# EAGLE design BT_IMU_2_0 (EAGLE 9.6.2)
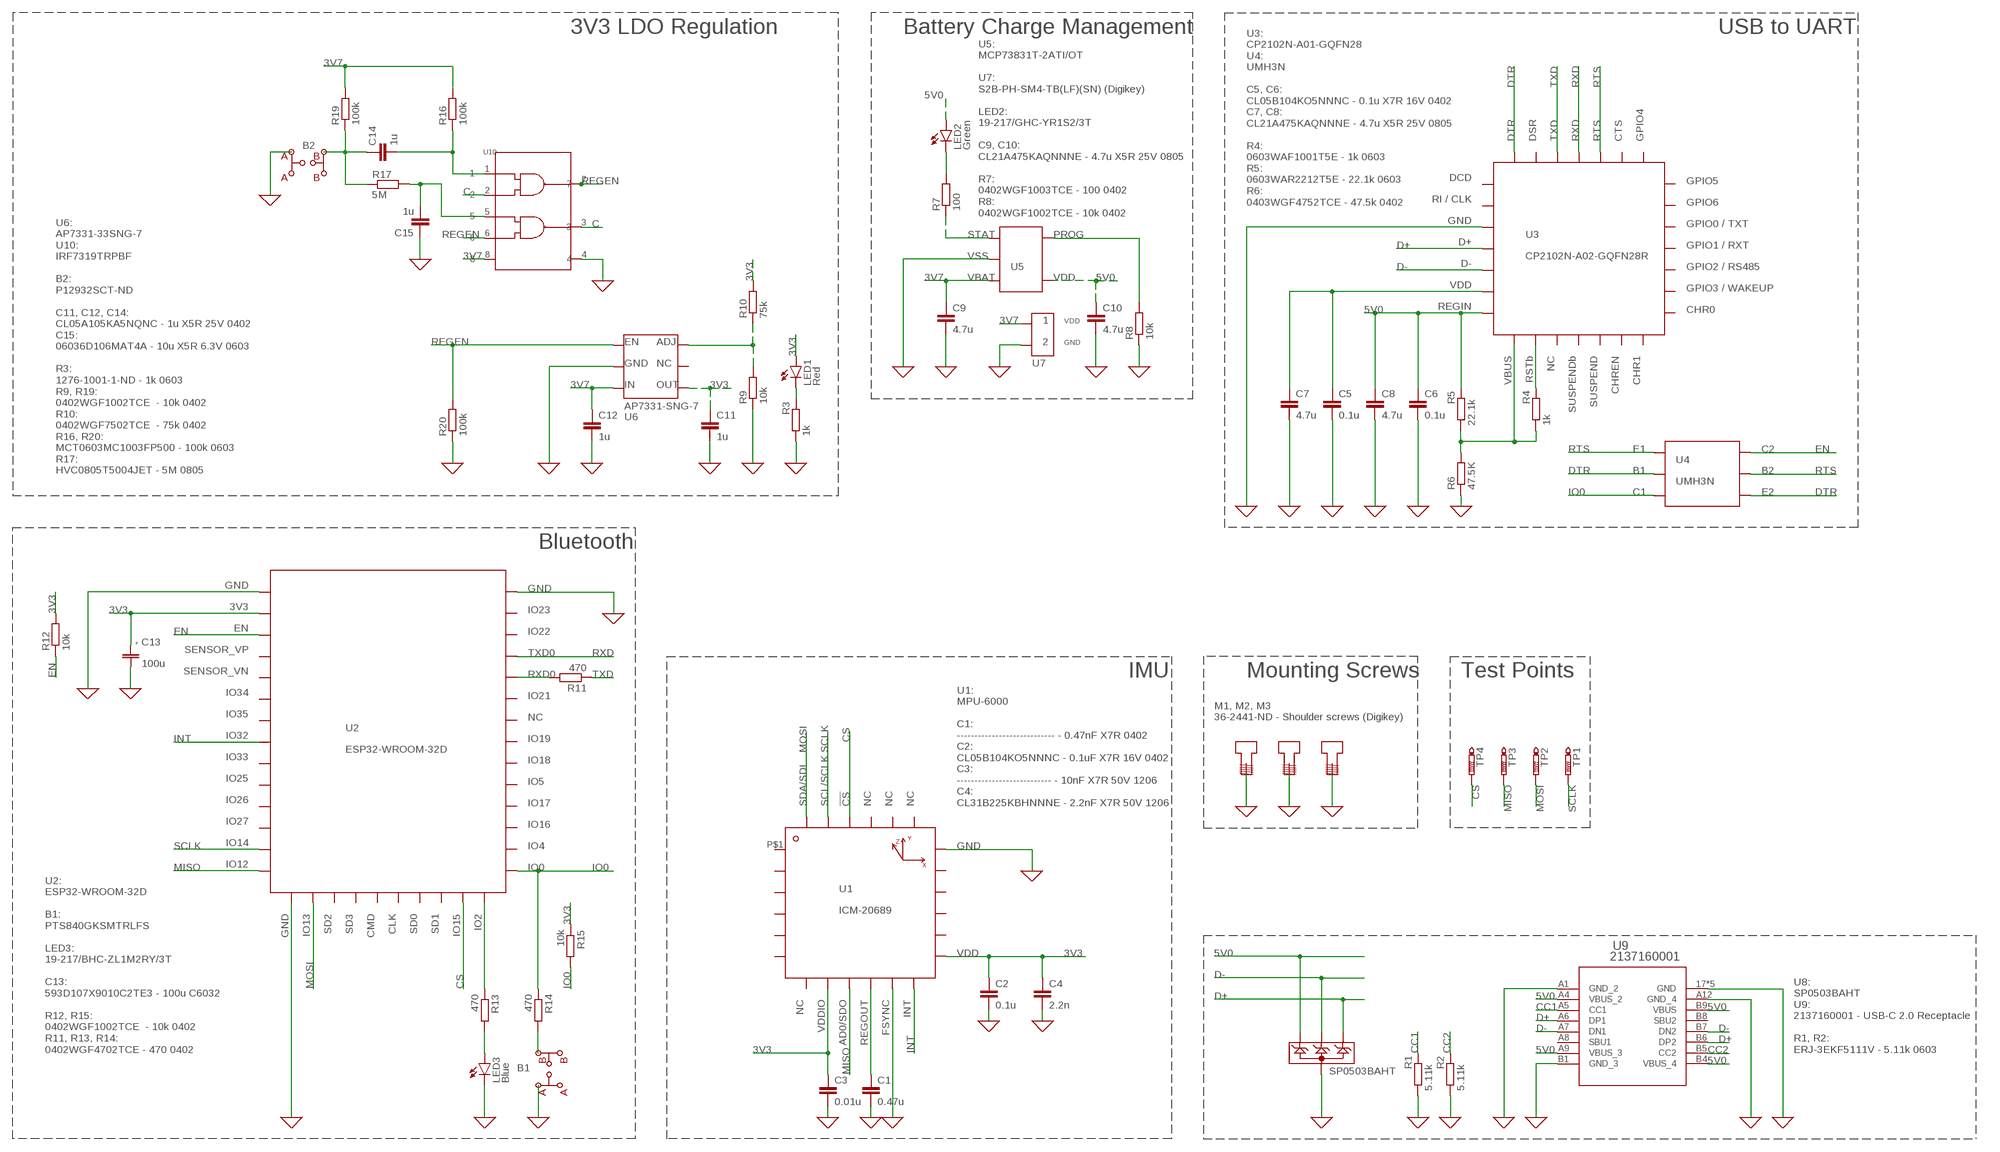
[diagram p0: schematic, sheet 1]

## Parts
B1  P12932SCT-ND  [P12932SCT-ND]
B2  P12932SCT-ND  [P12932SCT-ND]
C1  0.47u  C-EUC0603  [C0603]
C2  0.1u  C-EUC0402  [C0402]
C3  0.01u  C-EUC0402  [C0402]
C4  2.2n  C-EUC1206  [C1206]
C5  0.1u  C-EUC0402  [C0402]
C6  0.1u  C-EUC0402  [C0402]
C7  4.7u  C-EUC0805  [C0805]
C8  4.7u  C-EUC0805  [C0805]
C9  4.7u  C-EUC0805  [C0805]
C10  4.7u  C-EUC0805  [C0805]
C11  1u  C-EUC0402  [C0402]
C12  1u  C-EUC0402  [C0402]
C13  100u  593D107X9010C2TE3  [C6032]
C14  1u  C-EUC0402  [C0402]
C15  1u  C-EUC0603  [C0603]
LED1  Red  LEDCHIP-LED0603  [CHIP-LED0603]
LED2  Green  LEDSML0603  [SML0603]
LED3  Blue  LEDSML0603  [SML0603]
M1  2441  [2441]
M2  2441  [2441]
M3  2441  [2441]
R1  5.11k  R-EU_R0603  [R0603]
R2  5.11k  R-EU_R0603  [R0603]
R3  1k  R-EU_R0603  [R0603]
R4  1k  R-EU_R0603  [R0603]
R5  22.1k  R-EU_R0603  [R0603]
R6  47.5K  R-EU_R0402  [R0402]
R7  100  R-EU_R0402  [R0402]
R8  10k  R-EU_R0402  [R0402]
R9  10k  R-EU_R0402  [R0402]
R10  75k  R-EU_R0402  [R0402]
R11  470  R-EU_R0402  [R0402]
R12  10k  R-EU_R0402  [R0402]
R13  470  R-EU_R0402  [R0402]
R14  470  R-EU_R0402  [R0402]
R15  10k  R-EU_R0402  [R0402]
R16  100k  R-EU_R0603  [R0603]
R17  5M  R-EU_R0805  [R0805]
R19  100k  R-EU_R0603  [R0603]
R20  100k  R-EU_R0603  [R0603]
TP1  PTR1B1,27  [B1,27]
TP2  PTR1B1,27  [B1,27]
TP3  PTR1B1,27  [B1,27]
TP4  PTR1B1,27  [B1,27]
U1  ICM-20689  [24-QFN(4X4)]
U2  ESP32-WROOM-32D  [ESP32-WROOM-32D]
U3  CP2102N-A02-GQFN28R  [28-QFN(5X5)]
U4  UMH3N  [UMT6]
U5  MCP73831T-2ATI/OT  [SOT-23-5]
U6  AP7331-SNG-7  [U-DFN2020-6]
U7  S2B-PH-SM4-TB(LF)(SN)  [S2B-PH-SM4-TB(LF)(SN)]
U8  SP0503BAHT  [SOT-143-4]
U9  2137160001  [2137160001_MOL]
U10  TC7WZ00FKSOT-765  [SOT-765]

## Nets
0: B1.P$2 B2.P$2 C1.2 C2.2 C3.2 C4.2 C5.2 C6.2 C7.2 C8.2 C9.2 C10.2 C11.2 C12.2 C13.P$2 C15.1 LED3.C M1.P$1 M2.P$1 M3.P$1 R1.1 R2.1 R3.1 R6.1 R8.1 R9.1 R20.1 U1.P$11 U1.P$18 U2.P$1 U2.P$15 U2.P$38 U2.P$39 U2.P$40 U2.P$41 U2.P$42 U2.P$43 U2.P$44 U2.P$45 U2.P$46 U2.P$47 U3.P$2 U3.P$28 U3.P$29 U3.P$30 U3.P$31 U3.P$32 U3.P$33 U3.P$34 U3.P$35 U3.P$36 U5.P$2 U6.P$2 U6.P$7 U6.P$8 U7.P$2 U8.P$1 U9.17(GND) U9.18(GND) U9.19(GND) U9.20(GND) U9.A1(GND_2) U9.A12(GND_4) U9.B1(GND_3) U9.B12(GND) U10.4 ; supply symbol labelled GND
3V3: C2.1 C3.1 C4.1 C11.1 C13.P$1 LED1.A R10.2 R12.2 R15.1 U1.P$8 U1.P$13 U2.P$2 U6.P$4
3V7: C9.1 C12.1 R16.2 R19.2 U5.P$3 U6.P$3 U7.P$1 U10.8
5V0: C6.1 C8.1 C10.1 LED2.A R5.2 U3.P$6 U5.P$4 U8.P$2 U9.A4(VBUS_2) U9.A9(VBUS_3) U9.B4(VBUS_4) U9.B9(VBUS)
C: U10.2 U10.3
CC1: R1.2 U9.A5(CC1)
CC2: R2.2 U9.B5(CC2)
CS: TP4.TP U1.P$22 U2.P$23
D+: U3.P$3 U8.P$4 U9.A6(DP1) U9.B6(DP2)
D-: U3.P$4 U8.P$3 U9.A7(DN1) U9.B7(DN2)
DTR: U3.P$27 U4.P$2 U4.P$4
EN: R12.1 U2.P$3 U4.P$6
INT: U1.P$12 U2.P$8
IO0: R14.1 R15.2 U2.P$25 U4.P$3
MISO: TP3.TP U1.P$9 U2.P$14
MOSI: TP2.TP U1.P$24 U2.P$16
N$1: C1.1 U1.P$10
N$2: B1.P$4 R14.2
N$3: LED1.C R3.2
N$4: R4.2 U3.P$8
N$5: R4.1 R5.1 R6.2 U3.P$7
N$6: C5.1 C7.1 U3.P$5
N$7: R7.1 U5.P$1
N$8: R11.2 U2.P$34
N$9: R8.2 U5.P$5
N$10: LED2.C R7.2
N$11: R9.2 R10.1 U6.P$6
N$12: R13.1 U2.P$24
N$13: C15.2 R17.2 U10.5
N$14: B2.P$4 C14.1 R17.1 R19.1
N$15: LED3.A R13.2
N$16: C14.2 R16.1 U10.1
REGEN: R20.2 U6.P$1 U10.6 U10.7
RTS: U3.P$23 U4.P$1 U4.P$5
RXD: U2.P$35 U3.P$24
SCLK: TP1.TP U1.P$23 U2.P$13
TXD: R11.1 U3.P$25
Unconnected: B1.P$1 B1.P$3 B2.P$1 B2.P$3 U1.P$1 U1.P$2 U1.P$3 U1.P$4 U1.P$5 U1.P$6 U1.P$7 U1.P$14 U1.P$15 U1.P$16 U1.P$17 U1.P$19 U1.P$20 U1.P$21 U2.P$4 U2.P$5 U2.P$6 U2.P$7 U2.P$9 U2.P$10 U2.P$11 U2.P$12 U2.P$17 U2.P$18 U2.P$19 U2.P$20 U2.P$21 U2.P$22 U2.P$26 U2.P$27 U2.P$28 U2.P$29 U2.P$30 U2.P$31 U2.P$32 U2.P$33 U2.P$36 U2.P$37 U3.P$0 U3.P$1 U3.P$9 U3.P$10 U3.P$11 U3.P$12 U3.P$13 U3.P$14 U3.P$15 U3.P$16 U3.P$17 U3.P$18 U3.P$19 U3.P$20 U3.P$21 U3.P$22 U3.P$26 U6.P$5 U9.A8(SBU1) U9.B8(SBU2)

## Notes on the sheet
- 3V3 LDO Regulation | Battery Charge Management | USB to UART
- U3:
  CP2102N-A01-GQFN28
  U4:
  UMH3N
  
  C5, C6:
  CL05B104KO5NNNC - 0.1u X7R 16V 0402
  C7, C8:
  CL21A475KAQNNNE - 4.7u X5R 25V 0805
  
  R4:
  0603WAF1001T5E - 1k 0603
  R5:
  0603WAR2212T5E - 22.1k 0603
  R6:
  0403WGF4752TCE - 47.5k 0402
- U5:
  MCP73831T-2ATI/OT
  
  U7:
  S2B-PH-SM4-TB(LF)(SN) (Digikey)
  
  LED2:
  19-217/GHC-YR1S2/3T 
  
  C9, C10:
  CL21A475KAQNNNE - 4.7u X5R 25V 0805
  
  R7:
  0402WGF1003TCE - 100 0402
  R8:
  0402WGF1002TCE - 10k 0402
- U5
- U6
- U6:
  AP7331-33SNG-7
  U10:
  IRF7319TRPBF
  
  B2:
  P12932SCT-ND
  
  C11, C12, C14:
  CL05A105KA5NQNC - 1u X5R 25V 0402
  C15:
  06036D106MAT4A - 10u X5R 6.3V 0603
  
  R3:
  1276-1001-1-ND - 1k 0603
  R9, R19:
  0402WGF1002TCE  - 10k 0402
  R10:
  0402WGF7502TCE  - 75k 0402
  R16, R20:
  MCT0603MC1003FP500 - 100k 0603
  R17:
  HVC0805T5004JET - 5M 0805
- Bluetooth
- IMU | Mounting Screws | Test Points
- M1, M2, M3
  36-2441-ND - Shoulder screws (Digikey)
- U1:
  MPU-6000
  
  C1:
  ---------------------------- - 0.47nF X7R 0402
  C2:
  CL05B104KO5NNNC - 0.1uF X7R 16V 0402
  C3:
  --------------------------- - 10nF X7R 50V 1206
  C4:
  CL31B225KBHNNNE - 2.2nF X7R 50V 1206
- U2:
  ESP32-WROOM-32D
  
  B1:
  PTS840GKSMTRLFS
  
  LED3:
  19-217/BHC-ZL1M2RY/3T
  
  C13:
  593D107X9010C2TE3 - 100u C6032
  
  R12, R15:
  0402WGF1002TCE  - 10k 0402
  R11, R13, R14:
  0402WGF4702TCE - 470 0402
- U8:
  SP0503BAHT
  U9:
  2137160001 - USB-C 2.0 Receptacle
  
  R1, R2:
  ERJ-3EKF5111V - 5.11k 0603

## Library data of the parts
B1 B2 = Panasonic:P12932SCT-ND
C1-C12 C14 C15 = rcl:C-EU: CAPACITOR, European symbol; SPICEPREFIX: C
C13 = Vishay:593D107X9010C2TE3
LED1-LED3 = led:LED: LED OSRAM: - CHIPLED LG R971, LG N971, LY N971, LG Q971, LY Q971, LO R971, LY R971 LH N974, LH R974 LS Q976, LO Q976, LY Q976 LO Q996 - Hyper CHIPLED LW Q18S LB Q993, LB Q99A, LB R99A - SideLED LS A670, LO A670, LY A670, LG A670, LP A670 LB A673, LV A673, LT A673, LW A673 LH A674 LY A675 LS A676, LA A676, LO A676, LY A676, LW A676 LS A679, LY A679, LG A679 - Hyper Micro SIDELED® LS Y876, LA Y876, LO Y876, LY Y876 LT Y87S - SmartLED LW L88C, LW L88S LB L89C, LB L89S, LG L890 LS L89K, LO L89K, LY L89K LS L896, LA L896, LO L896, LY L896 - TOPLED LS T670, LO T670, LY T670, LG T670, LP T670 LSG T670, LSP T670, LSY T670, LOP T670, LYG T670 LG T671, LOG T671, LSG T671 LB T673, LV T673, LT T673, LW T673 LH T674 LS T676, LA T676, LO T676, LY T676, LB T676, LH T676, LSB T676, LW T676 LB T67C, LV T67C, LT T67C, LS T67K, LO T67K, LY T67K, LW E67C LS E67B, LA E67B, LO E67B, LY E67B, LB E67C, LV E67C, LT E67C LW T67C LS T679, LY T679, LG T679 LS T770, LO T770, LY T770, LG T770, LP T770 LB T773, LV T773, LT T773, LW T773 LH T774 LS E675, LA E675, LY E675, LS T675 LS T776, LA T776, LO T776, LY T776, LB T776 LHGB T686 LT T68C, LB T68C - Hyper Mini TOPLED® LB M676 - Mini TOPLED Santana® LG M470 LS M47K, LO M47K, LY M47K Source: http://www.osram.convergy.de LUXEON: - LUMILED® LXK2-PW12-R00, LXK2-PW12-S00, LXK2-PW14-U00, LXK2-PW14-V00 LXK2-PM12-R00, LXK2-PM12-S00, LXK2-PM14-U00 LXK2-PE12-Q00, LXK2-PE12-R00, LXK2-PE12-S00, LXK2-PE14-T00, LXK2-PE14-U00 LXK2-PB12-K00, LXK2-PB12-L00, LXK2-PB12-M00, LXK2-PB14-N00, LXK2-PB14-P00, LXK2-PB14-Q00 LXK2-PR12-L00, LXK2-PR12-M00, LXK2-PR14-Q00, LXK2-PR14-R00 LXK2-PD12-Q00, LXK2-PD12-R00, LXK2-PD12-S00 LXK2-PH12-R00, LXK2-PH12-S00 LXK2-PL12-P00, LXK2-PL12-Q00, LXK2-PL12-R00 Source: www.luxeon.com KINGBRIGHT: KA-3528ASYC Source: www.kingbright.com
M1-M3 = Keystone Electronics:2441
R1-R17 R19 R20 = rcl:R-EU_: RESISTOR, European symbol; SPICEPREFIX: R
TP1-TP4 = testpad:PTR1: TEST PIN
U1 = InvenSense:ICM-20689
U2 = ESPRESSIF:ESP32-WROOM-32D: ESPRESSIF ESP32-WROOM-32D development board
U3 = Silicon Labs:CP2102N-A02-GQFN28R
U4 = ROHM Semiconductor:UMH3N
U5 = Microchip:MCP73831T-2ATI/OT
U6 = Diodes Encorporated:AP7331-SNG-7: IC REG LIN POS ADJ 300MA 6DFN
U7 = JST:S2B-PH-SM4-TB(LF)(SN)
U8 = Littelfuse Inc:SP0503BAHT
U9 = USB Connectors:2137160001; BUILT_BY: EMA_Cory; COPYRIGHT: Copyright (C) 2018 Accelerated Designs. All rights reserved; DATASHEET: https://www.molex.com/pdm_docs/sd/2137160001_sd.pdf; MANUFACTURER_PART_NUMBER: 2137160001; SOURCELIBRARY: Add_to_database_2021-03-05; VENDOR: Molex Connector Corporation
U10 = Toshiba:TC7WZ00FK

## Board
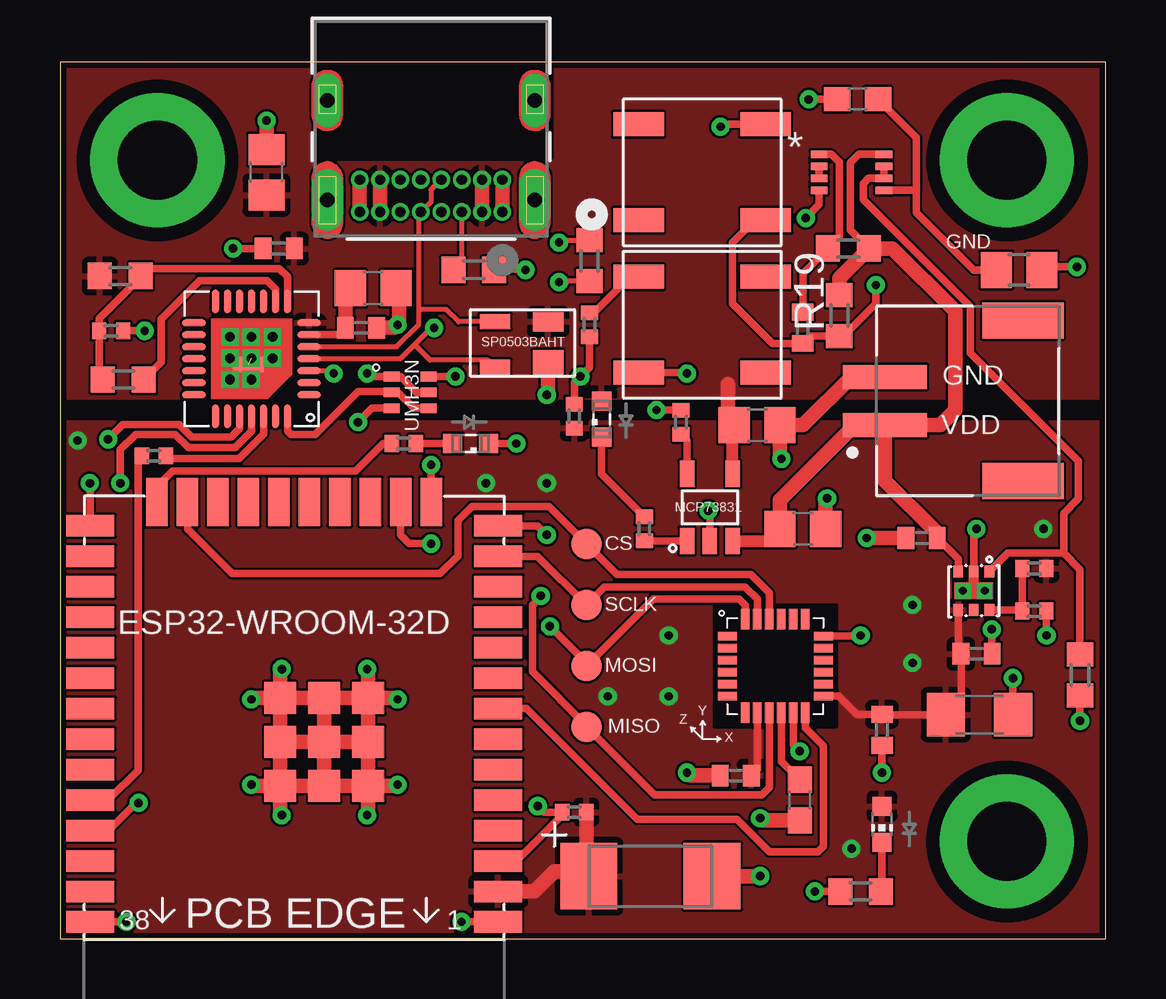
[diagram p1: board, top side]
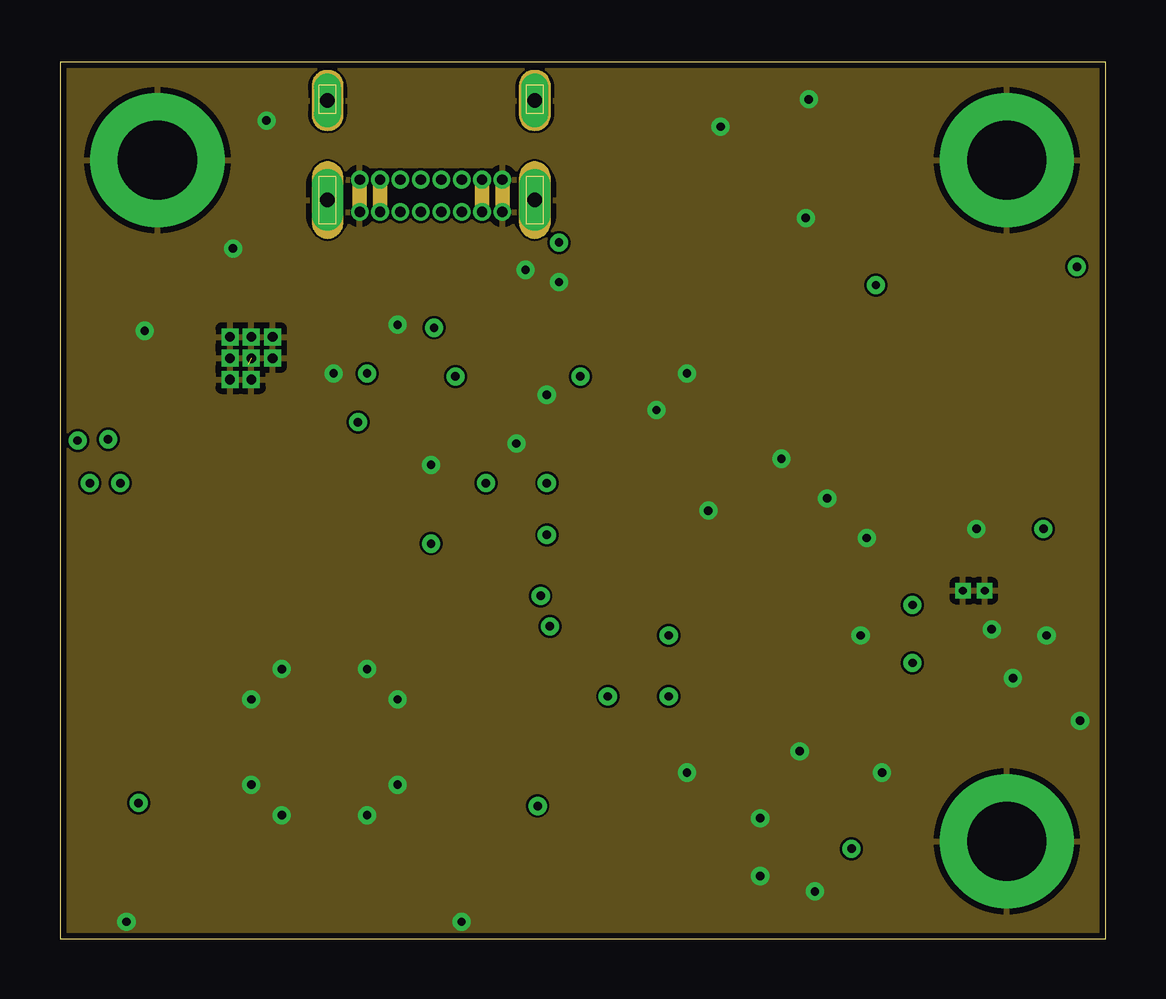
[diagram p2: board, inner layer Route2]
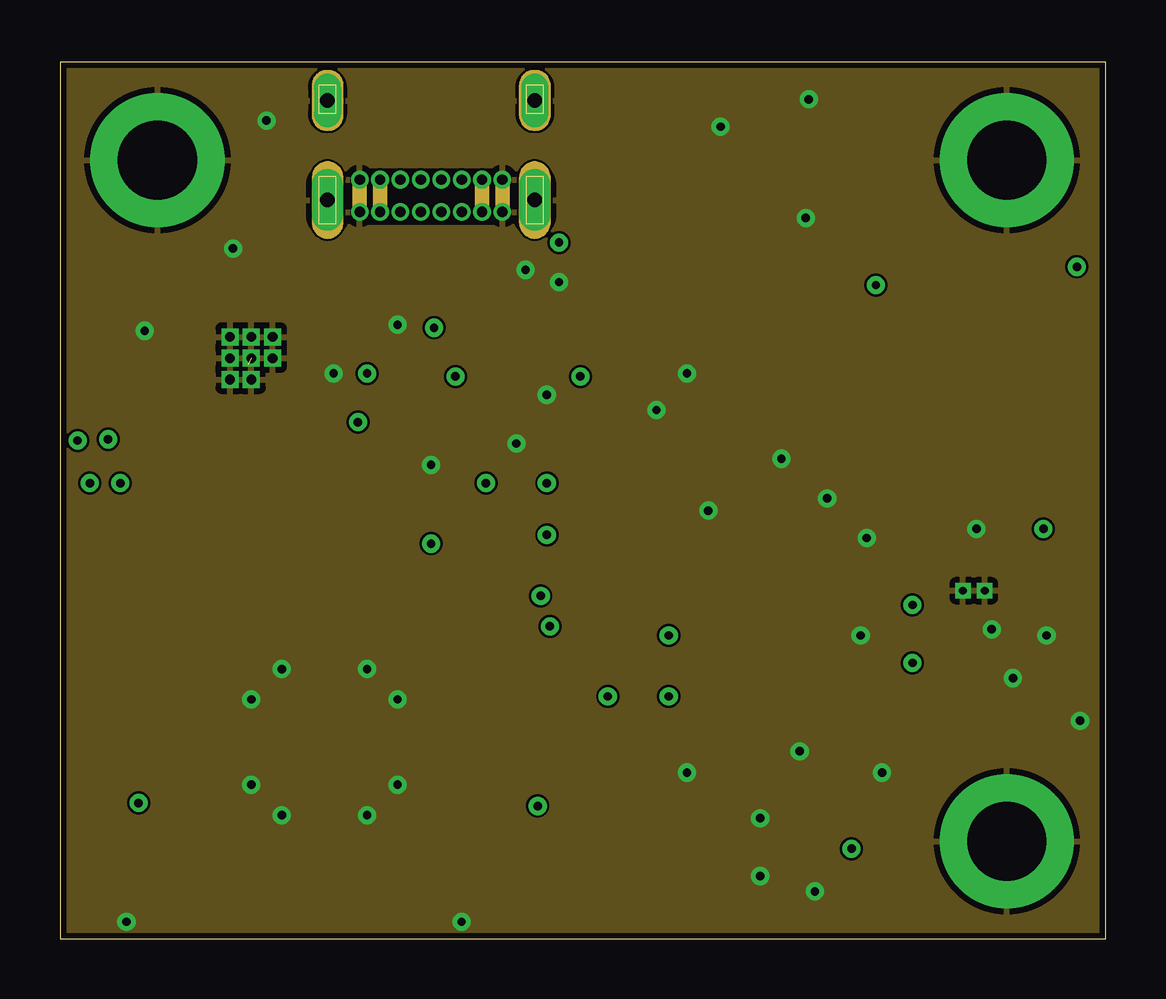
[diagram p3: board, inner layer Route15]
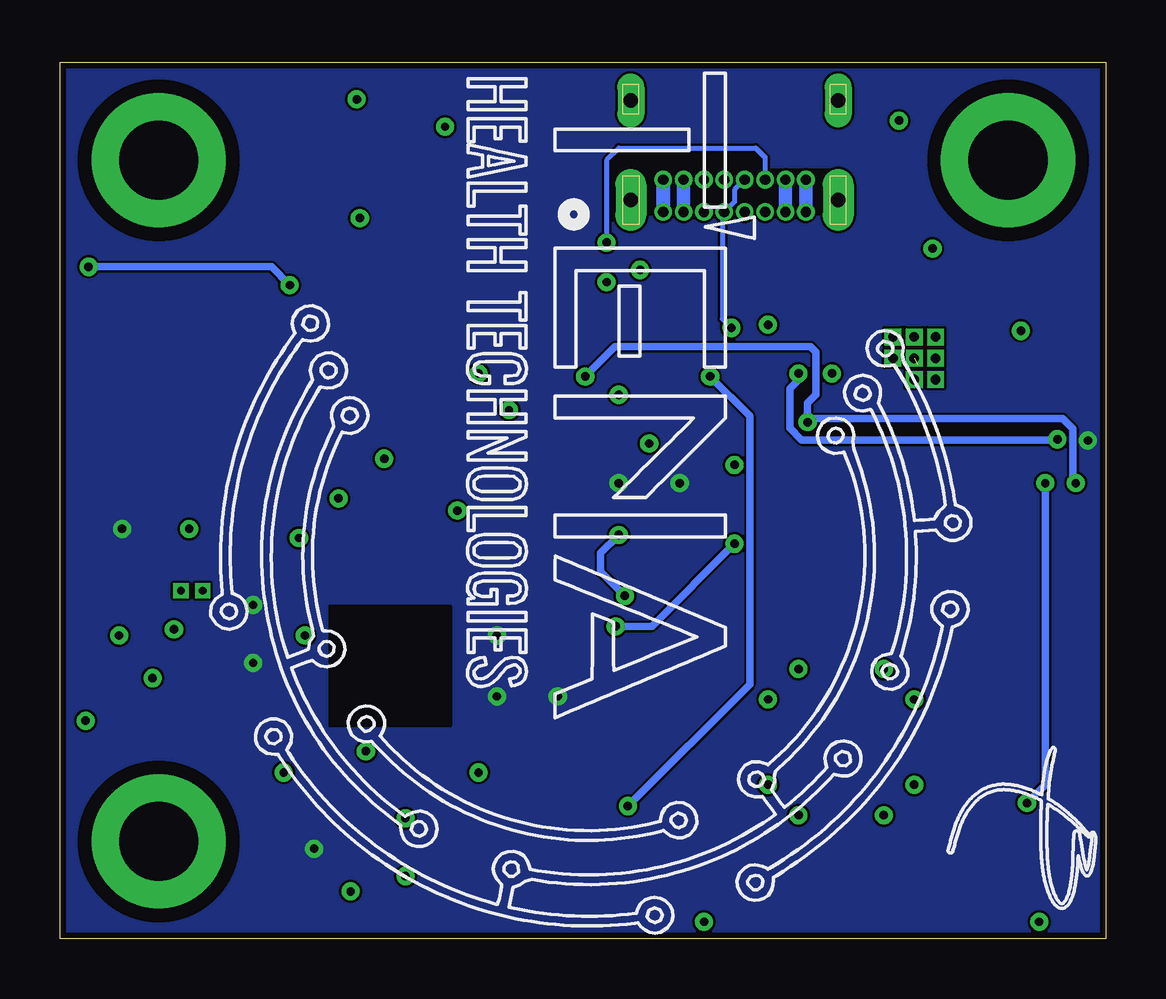
[diagram p4: board, bottom side, seen from below]

Size 43.59 x 36.55 mm. Coordinates in mm from the lower left corner, seen from the top.
Outline: 0,0 43.59,0 43.59,36.55 0,36.55 0,0
Copper layers (1+2*15+16): Top 0.018mm / dielectric 0.11mm / Route2 0.018mm / dielectric 1.164mm / Route15 0.018mm / dielectric 0.11mm / Bottom 0.018mm
Design rules "default *": minimum track width 3mil, minimum drill 6mil, track to track 4mil, track to pad 4mil, pad to pad 4mil, via to via 4mil, smd to smd 4mil, copper to edge 10mil, drill to drill 6mil, minimum pad ring 6mil, minimum via ring 8mil, stop-mask expansion 4mil, vias tented up to drill 0mil, thermal gap 10mil

### Footprints (pad centres in the part's own frame; a part is rotated, then mirrored left to right if it is on the bottom)
P12932SCT-ND = smd 2.1 x 1: P$1 -2.65,2; P$2 2.65,2; P$3 -2.65,-2; P$4 2.65,-2
C0603 = smd 1.1 x 1: 1 -0.85,0; 2 0.85,0
C0402 = smd 0.7 x 0.9: 1 -0.65,0; 2 0.65,0
C1206 = smd 1.6 x 1.8: 1 -1.4,0; 2 1.4,0
C0805 = smd 1.3 x 1.5: 1 -0.95,0; 2 0.95,0
C6032 = smd 2.37 x 2.77: P$1 -2.57,0; P$2 2.57,0
CHIP-LED0603 = smd 0.8 x 0.8: A 0,-0.75; C 0,0.75
SML0603 = smd 0.8 x 0.8: A 0.75,0; C -0.75,0
2441 = drill 3.3 pad 5.588: P$1 0,0
R0603 = smd 1 x 1.1: 1 -0.85,0; 2 0.85,0
R0402 = smd 0.6 x 0.7: 1 -0.5,0; 2 0.5,0
R0805 = smd 1.3 x 1.5: 1 -0.95,0; 2 0.95,0
B1,27 = smd 1.27 x 1.27: TP 0,0
24-QFN(4X4) = smd 0.8 x 0.35: P$1 -2,1.247; P$2 -2,0.747; P$3 -2,0.247; P$4 -2,-0.253; P$5 -2,-0.753; P$6 -2,-1.253; P$13 2,-1.253; P$14 2,-0.753; P$15 2,-0.253; P$16 2,0.247; P$17 2,0.747; P$18 2,1.247 | smd 0.35 x 0.85: P$7 -1.25,-1.95; P$8 -0.75,-1.95; P$9 -0.25,-1.95; P$10 0.25,-1.95; P$11 0.75,-1.95; P$12 1.25,-1.95; P$19 1.25,1.95; P$20 0.75,1.95; P$21 0.25,1.95; P$22 -0.25,1.95; P$23 -0.75,1.95; P$24 -1.25,1.95
ESP32-WROOM-32D = smd 2 x 0.9: P$1 0,0; P$2 0,-1.27; P$3 0,-2.54; P$4 0,-3.81; P$5 0,-5.08; P$6 0,-6.35; P$7 0,-7.62; P$8 0,-8.89; P$9 0,-10.16; P$10 0,-11.43; P$11 0,-12.7; P$12 0,-13.97; P$13 0,-15.24; P$14 0,-16.51; P$25 17,-16.51; P$26 17,-15.24; P$27 17,-13.97; P$28 17,-12.7; P$29 17,-11.43; P$30 17,-10.16; P$31 17,-8.89; P$32 17,-7.62; P$33 17,-6.35; P$34 17,-5.08; P$35 17,-3.81; P$36 17,-2.54; P$37 17,-1.27; P$38 17,0 | smd 0.9 x 2: P$15 2.785,-17.51; P$16 4.055,-17.51; P$17 5.325,-17.51; P$18 6.595,-17.51; P$19 7.865,-17.51; P$20 9.135,-17.51; P$21 10.405,-17.51; P$22 11.675,-17.51; P$23 12.945,-17.51; P$24 14.215,-17.51 | smd 1.33 x 1.33: P$39 5.415,-5.665; P$40 7.25,-5.665; P$41 9.085,-5.665; P$42 5.415,-7.5; P$43 7.25,-7.5; P$44 9.085,-7.5; P$45 5.415,-9.335; P$46 7.25,-9.335; P$47 9.085,-9.335
28-QFN(5X5) = smd 1 x 0.3: P$0 0,0; P$1 0,-0.5; P$2 0,-1; P$3 0,-1.5; P$4 0,-2; P$5 0,-2.5; P$6 0,-3; P$14 4.8,-3; P$15 4.8,-2.5; P$16 4.8,-2; P$17 4.8,-1.5; P$18 4.8,-1; P$19 4.8,-0.5; P$20 4.8,0 | smd 0.3 x 1: P$7 0.9,-3.9; P$8 1.4,-3.9; P$9 1.9,-3.9; P$10 2.4,-3.9; P$11 2.9,-3.9; P$12 3.4,-3.9; P$13 3.9,-3.9; P$21 3.9,0.9; P$22 3.4,0.9; P$23 2.9,0.9; P$24 2.4,0.9; P$25 1.9,0.9; P$26 1.4,0.9; P$27 0.9,0.9 | smd 1.27 x 0.635: P$28 2.54,-1.27 | drill 0.4 square: P$29 3.302,-0.635; P$30 2.413,-0.635; P$31 3.302,-1.524; P$32 2.413,-1.524; P$33 3.302,-2.413; P$34 2.413,-2.413; P$35 1.524,-1.524; P$36 1.524,-2.413
UMT6 = smd 0.66 x 0.406: P$1 0,0; P$2 0,-0.66; P$3 0,-1.321; P$4 1.549,-1.321; P$5 1.549,-0.66; P$6 1.549,0
SOT-23-5 = smd 1.1 x 0.6: P$1 0,1.9; P$2 0,0.95; P$3 0,0; P$4 2.8,0; P$5 2.8,1.9
U-DFN2020-6 = smd 0.5 x 0.4: P$1 0,1.3; P$2 0,0.65; P$3 0,0; P$4 1.6,0; P$5 1.6,0.65; P$6 1.6,1.3 | drill 0.33 pad 0.61 square: P$7 0.8,1.105; P$8 0.8,0.203
S2B-PH-SM4-TB(LF)(SN) = smd 3.5 x 1: P$1 3.81,1; P$2 3.81,-1 | smd 3.4 x 1.5: S1 -1.94,3.35; S2 -1.94,-3.35
SOT-143-4 = smd 1.016 x 1.27: P$1 0.203,-2.21 | smd 0.813 x 1.27: P$2 1.905,-2.21 | smd 0.635 x 1.27: P$3 1.905,0; P$4 0,0
2137160001_MOL = drill 0.6 pad 1.3 long: 17 -4.32,-0.5; 18 4.32,-0.5 | drill 0.6 pad 1.125 long: 19 -4.32,-4.65; 20 4.32,-4.65 | drill 0.43 pad 0.73: A1 -2.975,0; A4 -2.125,0; A5 -1.275,0; A6 -0.425,0; A7 0.425,0; A8 1.275,0; A9 2.125,0; A12 2.975,0; B1 2.975,-1.35; B4 2.125,-1.35; B5 1.275,-1.35; B6 0.425,-1.35; B7 -0.425,-1.35; B8 -1.275,-1.35; B9 -2.125,-1.35; B12 -2.975,-1.35
SOT-765 = smd 0.7 x 0.3: 1 -1.35,0.75; 2 -1.35,0.25; 3 -1.35,-0.25; 4 -1.35,-0.75; 5 1.35,-0.75; 6 1.35,-0.25; 7 1.35,0.25; 8 1.35,0.75

### Placement (x,y rotation side)
B1  26.77,25.6 180 top
B2  26.77,31.95 0 top
C1  30.84,5.79 270 top
C2  34.26,8.71 270 top
C3  28.17,6.81 180 top
C4  38.33,9.35 0 top
C5  12.55,25.48 0 top
C6  9.12,28.78 180 top
C7  13.06,27.13 0 top
C8  8.61,31.95 90 top
C9  30.96,17.09 0 top
C10  29.06,21.41 0 top
C11  38.2,11.89 0 top
C12  35.92,16.71 180 top
C13  24.61,2.62 0 top
C14  30.96,25.48 90 top
C15  33.25,35 0 top
LED1  34.26,4.78 180 top
LED2  22.58,21.67 90 top
LED3  17.12,20.65 180 top
M1  39.47,4.06 0 top
M2  39.47,32.46 0 top
M3  4.06,32.46 0 top
R1  17.25,27.89 180 top
R2  22.07,28.27 90 top
R3  33.38,1.98 0 top
R4  2.64,23.32 0 top
R5  2.51,27.64 180 top
R6  2.13,25.35 180 top
R7  24.36,17.09 90 top
R8  25.88,21.54 270 top
R9  40.61,13.67 180 top
R10  40.61,15.44 0 top
R11  3.91,20.14 180 top
R12  21.44,5.28 0 top
R13  14.33,20.65 0 top
R14  22.07,25.6 90 top
R15  21.44,21.79 90 top
R16  32.87,28.78 0 top
R17  39.98,27.89 180 top
R19  32.49,25.98 90 top
R20  42.52,11 90 top
TP1  21.95,13.92 0 top
TP2  21.95,11.38 0 top
TP3  21.95,8.84 0 top
TP4  21.95,16.46 0 top
U1  29.82,11.38 0 top
U2  18.26,0.71 180 top
U3  10.39,22.68 180 top
U4  13.82,23.44 0 top
U5  28.04,16.59 90 top
U6  37.44,15.32 270 top
U7  38.2,22.43 180 top
U8  18.14,23.83 90 top
U9  15.47,30.3 180 top
U10  32.99,31.95 0 top
U$1  [SIGNATURE]  2.51,5.79 90 top
U$2  [TENA_LOGO]  20.8,14.55 90 top

### Tracks (layer width: path | path; a pad name or v marks a point on that pad's centre or on a via)
0  (via drill 0.35)  (1 unrouted)
  Top 0.203: U3.P$2 11.29,23.68 v11.4,23.57 | R1.1 v19.41,27.89 | R2.1 20.84,27.42 v20.8,27.38
  Top 0.305: U1.P$11 30.57,8.09 v30.84,7.82 | U2.P$15 15.48,19.75 v15.47,19.76 | U2.P$38 v2.77,0.71 | U2.P$1 v16.74,0.71 | U1.P$18 33.35,12.63 v33.38,12.65 | R8.1 v24.87,22.05 | LED3.C v19.02,20.65 | v3.53,25.35 R6.1 | C11.2 38.84,11.9 v38.84,12.9 | C4.2 v39.73,10.87 | R9.1 41.12,13.66 v41.12,12.65 | U6.P$2 38.09,16.98 v38.2,17.09 | U5.P$2 27.09,17.79 v27.03,17.86 | C2.2 v34.26,6.93 | R20.1 v42.52,9.09 | R3.1 v31.47,1.98 | C15.1 v31.22,35 | U9.19 20.16,34.58 | C6.2 v7.21,28.78 | U10.4 31.64,30.6 v31.09,30.05 | B2.P$2 27.63,33.95 v27.53,33.86 | B1.P$2 26.1,23.6 v26.14,23.57
  Top 0.61: C1.2 29.27,4.94 v29.18,5.03 | C3.2 26.26,6.81 v26.14,6.93 | U7.P$2 32.99,23.43 30.98,21.41 C10.2 30.01,20.08 v30.07,20.02 | v31.98,18.36 31.91,18.3 C9.2 | U8.P$1 20.35,22.73 v20.29,22.68 | C8.2 v8.61,34.11 | C5.2 13.94,25.48 v14.07,25.6 14.13,25.66 14.13,27 C7.2 | C13.P$2 v29.18,2.62 | U2.P$47 U2.P$46 | U2.P$45 U2.P$46 | U2.P$44 U2.P$43 | U2.P$42 U2.P$43 | U2.P$41 U2.P$40 | U2.P$39 U2.P$40 | U2.P$47 U2.P$44 | U2.P$46 U2.P$43 | U2.P$45 U2.P$42 | U2.P$39 U2.P$42 | U2.P$40 U2.P$43 | U2.P$41 U2.P$44 | U2.P$47 9.18,11.18 v9.25,11.25 | U2.P$45 12.85,11.21 v12.8,11.25 | U2.P$47 8.04,10.05 v7.98,9.98 | U2.P$41 8.03,6.38 v7.98,6.43 | U2.P$41 9.18,5.22 v9.25,5.16 | U2.P$39 12.85,5.2 v12.8,5.16 | U2.P$45 14.01,10.05 v14.07,9.98 | U2.P$39 14.02,6.38 v14.07,6.43 | C12.2 v33.63,16.71
  pour Route2: -0.03,36.53 43.59,36.53 43.59,-0.05 -0.03,-0.05
  pour Route15: -0.03,36.53 43.59,36.53 43.59,-0.05 -0.03,-0.05
3V3  (via drill 0.35)
  Top 0.305: U1.P$8 29.07,7.06 C3.1 | U1.P$13 32.45,10.13 33.22,9.36 C2.1 34.28,9.35 C4.1 37.57,9.35 37.57,11.87 C11.1 37.44,12 U6.P$4
  Top 0.61: R12.2 21.94,2.89 21.85,2.81 20.61,2.81 19.79,1.98 U2.P$2
  other vias: 17.75,19 20.29,19 35.53,11.51 35.53,13.92 25.37,12.65 22.83,10.11 25.37,10.11 32.99,3.76 0.74,20.78 41,17.09
  pour Top: -0.03,21.54 -0.03,-0.05 43.59,-0.05 43.59,21.54
  pour Bottom: -0.03,36.53 43.59,36.53 43.59,-0.05 -0.03,-0.05
  cutout Top: 27.28,13.92 32.36,13.92 32.36,8.84 27.28,8.84
3V7
  Top 0.305: R16.2 32.96,29.54 32.96,32.36 33.3,32.7 U10.8 | U6.P$3 37.44,15.84 C12.1
  Top 0.508: U5.P$3 29.5,16.59 C9.1
  Top 0.61: C9.1 30.01,18.3 33.14,21.43 U7.P$1 | U7.P$1 36.69,21.43 37.31,22.05 37.31,26.17 34.7,28.78 R16.2 32.49,27.55 R19.2 | C12.1 36.57,16.92 34.39,19.09 U7.P$1
5V0
  Top 0.508: U5.P$4 28.04,21.35
  Top 0.61: 28.04,21.35 C10.1 27.85,21.67 27.85,23.13
  pour Top: -0.03,36.53 -0.03,22.56 43.59,22.56 43.59,36.53
  cutout Route2: 12.93,31.95 18.01,31.95 18.01,30.3 12.93,30.3
5V1
  cutout Top: 10.64,36.53 20.42,36.53 20.42,32.59 10.64,32.59
5V2
  cutout Route15: 12.93,31.95 18.01,31.95 18.01,29.92 12.93,29.92
5V3
  cutout Bottom: 11.53,31.95 19.41,31.95 19.41,30.3 11.53,30.3
C
  Top 0.305: U10.2 U10.3
CC1
  Top 0.203: U9.A5 16.74,28.24 R1.2
CC2  (via drill 0.35)
  Top 0.203: v20.8,29.03 20.89,29.12 R2.2
  Bottom 0.203: v20.8,29.03 20.8,32.46 20.29,32.97 14.58,32.97 14.19,32.58 U9.B5
CS
  Top 0.305: U1.P$22 29.57,14.42 28.8,15.19 23.22,15.19 TP4.TP 20.38,18.03 17.17,18.03 16.58,17.44 16.58,15.97 15.85,15.23 7.17,15.23 5.32,17.08 U2.P$23
D+  (via drill 0.35)
  Top 0.203: 14.78,24.77 14.19,24.18 U3.P$3 | U8.P$4 17.83,24.13 15.42,24.13 14.78,24.77 | v15.6,25.48 15.48,25.48 14.78,24.77
  Bottom 0.203: v15.6,25.48 15.98,25.86 15.98,30.22 U9.A6 15.47,30.73 15.47,31.23 U9.B6
D-
  Top 0.203: U3.P$4 14.04,24.68 14.97,25.61 14.97,26.24 | U8.P$3 16.61,25.73 16.1,26.24 14.97,26.24 | 14.97,26.24 14.97,30.23 U9.A7 15.47,30.73 15.47,31.23 U9.B7
DTR
  Top 0.305: U3.P$27 9.49,21.17 9.63,21.03 10.64,21.03 12.42,22.81 13.79,22.81 U4.P$2 14.1,22.78 14.76,22.12 U4.P$4
EN  (via drill 0.35)
  Top 0.305: U2.P$3 19.02,3.25 20.94,5.16 R12.1 20.17,5.28 v19.91,5.54 | U4.P$6 v16.48,23.44
  Bottom 0.305: v19.91,5.54 14.83,10.62 14.83,21.79 v16.48,23.44
INT
  Top 0.305: U2.P$8 19.45,9.6 24.07,4.99 28.21,4.99 29.57,3.63 31.6,3.63 31.82,3.85 31.82,8.05 31.07,8.8 U1.P$12
IO0  (via drill 0.35)
  Top 0.305: U2.P$25 1.26,18.98 v1.24,19 | v12.42,21.54 13,22.12 U4.P$3 | R15.2 21.44,23.19 v21.69,23.44 22.07,23.83 R14.1
  Bottom 0.305: v1.24,19 1.37,19.13 1.37,21.29 1.77,21.69 12.27,21.69 v12.42,21.54 12.42,22.33 12.07,22.69 12.07,24.46 12.3,24.69 20.45,24.69 v21.69,23.44
MISO  (via drill 0.35)
  Top 0.305: U1.P$9 29.57,6.31 29.26,6 24.78,6 TP3.TP 21.95,8.89 19.69,11.15 19.69,13.92 20.04,14.27 v20.04,14.3 | U2.P$14 19.91,17.22 v20.29,16.84
  Bottom 0.305: v20.29,16.84 21.06,16.08 21.06,15.32 v20.04,14.3
MOSI  (via drill 0.35)
  Top 0.305: U1.P$24 28.57,13.9 28.3,14.17 24.74,14.17 TP2.TP 21.95,11.51 v20.42,13.03 | U2.P$16 14.21,16.83 14.56,16.47 v15.47,16.47
  Bottom 0.305: v20.42,13.03 18.91,13.03 v15.47,16.47
N$1
  Top 0.305: U1.P$10 30.07,7.41 C1.1
N$2
  Top 0.305: R14.2 22.26,26.1 23.76,27.6 B1.P$4
N$3
  Top 0.305: LED1.C 34.26,2.02 R3.2
N$4
  Top 0.305: U3.P$8 8.99,27.09 8.65,27.44 5.82,27.44 4.22,25.84 4.22,24.05 R4.2
N$5
  Top 0.305: R4.1 1.63,23.48 R6.2 1.63,25.86 3.36,27.59 R5.1 3.68,27.95 9.15,27.95 9.49,27.6 U3.P$7
N$6
  Top 0.305: U3.P$5 11.6,25.18 C5.1
  Top 0.61: C5.1 11.9,26.92 C7.1
N$7
  Top 0.305: R7.1 26.13,16.59
  Top 0.61: 26.13,16.59 U5.P$1
N$8
  Top 0.305: R11.2 3.25,19.98 3.25,7.02 2.02,5.79 U2.P$34
N$9
  Top 0.305: R8.2 26.14,20.78 U5.P$5
N$10
  Top 0.305: R7.2 22.58,19.37 LED2.C
N$11
  Top 0.305: U6.P$6 40.06,13.72 R9.2 R10.1
N$12
  Top 0.305: U2.P$24 4.05,18.85 4.7,19.51 12.32,19.51 13.47,20.65 R13.1
N$13
  Top 0.305: C15.2 35.7,33.4 35.7,31.23 | R17.2 38.08,27.89 35.7,30.27 35.7,31.23 | 35.7,31.23 35.67,31.2 U10.5
N$14  (via drill 0.35)
  Top 0.305: B2.P$4 28.96,29.95 28.04,29.03 28.04,26.49 29.71,24.83 C14.1 31.27,25.13 R19.1 32.65,25.13 34.01,26.49 v34.01,27.25 | R17.1 41.06,28.02 v42.39,28.02
  Bottom 0.305: v42.39,28.02 34.77,28.02 v34.01,27.25
N$15
  Top 0.305: R13.2 LED3.A
N$16
  Top 0.305: C14.2 30.96,27.72 R16.1 32.49,29.25 32.49,32.37 32.16,32.7 U10.1
REGEN
  Top 0.305: R20.2 42.52,15.39 41.83,16.08 | 41.83,16.08 39.5,16.08 U6.P$1 | 41.83,16.08 41.83,17.74 42.45,18.36 42.45,19.92 37.95,24.43 37.95,26.37 33.49,30.83 33.49,31.49 33.7,31.7 U10.6 U10.7
RTS  (via drill 0.35)
  Top 0.305: U3.P$23 7.49,21.27 7.15,20.93 5.48,20.93 4.97,21.44 2.62,21.44 v2.01,20.83 | v12.8,23.57 12.93,23.44 U4.P$1 14.2,23.44 14.86,22.78 U4.P$5
  Bottom 0.305: v2.01,20.83 2.03,20.81 12.67,20.81 13.15,21.29 13.15,22.93 12.8,23.29 v12.8,23.57
RXD  (via drill 0.35)
  Top 0.305: U3.P$24 7.99,21.17 7.29,20.48 5.36,20.48 4.8,21.03 3.15,21.03 2.51,20.4 v2.51,19 | v3.28,5.66 3.17,5.66 2.02,4.52 U2.P$35
  Bottom 0.305: v2.51,19 2.51,6.43 v3.28,5.66
SCLK
  Top 0.305: U1.P$23 29.07,14.16 28.55,14.68 22.71,14.68 TP1.TP 19.91,15.95 U2.P$13
TXD
  Top 0.305: U3.P$25 8.49,21.04 7.47,20.02 4.54,20.02 R11.1

### Text on the board
tPlace: GND | CS | SCLK | MOSI | MISO
tDocu: U3 | U8 | U4 | U7 | U5 | U2 | U6 | U1